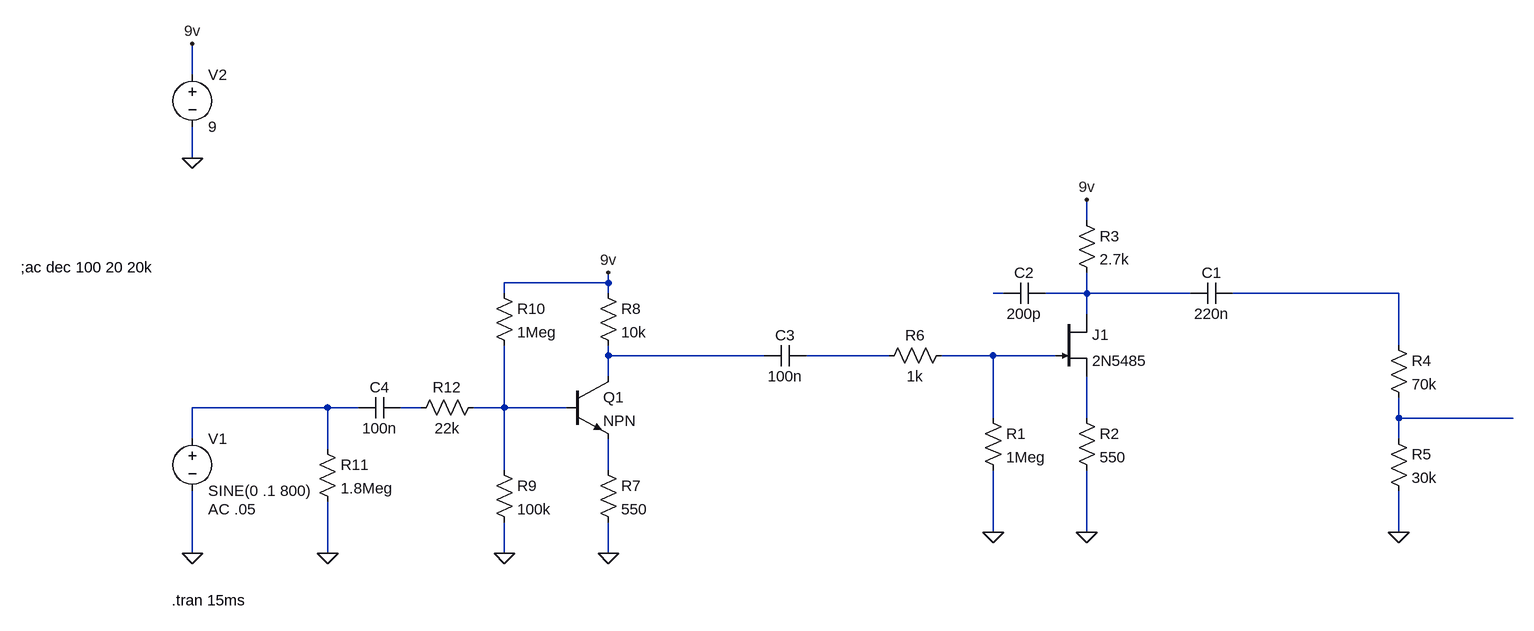
[diagram p0: schematic BJT_into_JFET.asc]
BJT_into_JFET.asc, the LTspice schematic file:
Version 4
SHEET 1 1188 680
WIRE -848 -192 -848 -240
WIRE -848 -64 -848 -112
WIRE 528 32 528 0
WIRE -208 128 -208 112
WIRE -208 128 -368 128
WIRE -368 144 -368 128
WIRE -208 144 -208 128
WIRE 400 144 384 144
WIRE 528 144 528 112
WIRE 528 144 464 144
WIRE 688 144 528 144
WIRE 1008 144 752 144
WIRE 528 176 528 144
WIRE 1008 224 1008 144
WIRE -208 240 -208 224
WIRE 32 240 -208 240
WIRE 224 240 96 240
WIRE 384 240 304 240
WIRE 480 240 384 240
WIRE -208 272 -208 240
WIRE -640 320 -848 320
WIRE -592 320 -640 320
WIRE -496 320 -528 320
WIRE -368 320 -368 224
WIRE -368 320 -416 320
WIRE -272 320 -368 320
WIRE 384 336 384 240
WIRE 528 336 528 272
WIRE 1008 336 1008 304
WIRE 1184 336 1008 336
WIRE -848 368 -848 320
WIRE 1008 368 1008 336
WIRE -640 384 -640 320
WIRE -368 416 -368 320
WIRE -208 416 -208 368
WIRE 384 512 384 416
WIRE 528 512 528 416
WIRE 1008 512 1008 448
WIRE -848 544 -848 448
WIRE -640 544 -640 464
WIRE -368 544 -368 496
WIRE -208 544 -208 496
FLAG 528 512 0
FLAG 384 512 0
FLAG 528 0 9v
FLAG 1008 512 0
FLAG -208 112 9v
FLAG -208 544 0
FLAG -368 544 0
FLAG -848 544 0
FLAG -640 544 0
FLAG -848 -64 0
FLAG -848 -240 9v
SYMBOL njf 480 176 R0
SYMATTR InstName J1
SYMATTR Value 2N5485
SYMBOL res 368 320 R0
SYMATTR InstName R1
SYMATTR Value 1Meg
SYMBOL res 512 320 R0
SYMATTR InstName R2
SYMATTR Value 550
SYMBOL res 512 16 R0
SYMATTR InstName R3
SYMATTR Value 2.7k
SYMBOL cap 752 128 R90
WINDOW 0 0 32 VBottom 2
WINDOW 3 32 32 VTop 2
SYMATTR InstName C1
SYMATTR Value 220n
SYMBOL res 992 208 R0
SYMATTR InstName R4
SYMATTR Value 70k
SYMBOL res 992 352 R0
SYMATTR InstName R5
SYMATTR Value 30k
SYMBOL cap 464 128 R90
WINDOW 0 0 32 VBottom 2
WINDOW 3 32 32 VTop 2
SYMATTR InstName C2
SYMATTR Value 200p
SYMBOL res 320 224 R90
WINDOW 0 0 56 VBottom 2
WINDOW 3 32 56 VTop 2
SYMATTR InstName R6
SYMATTR Value 1k
SYMBOL npn -272 272 R0
SYMATTR InstName Q1
SYMBOL cap 96 224 R90
WINDOW 0 0 32 VBottom 2
WINDOW 3 32 32 VTop 2
SYMATTR InstName C3
SYMATTR Value 100n
SYMBOL cap -528 304 R90
WINDOW 0 0 32 VBottom 2
WINDOW 3 32 32 VTop 2
SYMATTR InstName C4
SYMATTR Value 100n
SYMBOL res -224 400 R0
SYMATTR InstName R7
SYMATTR Value 550
SYMBOL res -224 128 R0
SYMATTR InstName R8
SYMATTR Value 10k
SYMBOL res -384 400 R0
SYMATTR InstName R9
SYMATTR Value 100k
SYMBOL res -384 128 R0
SYMATTR InstName R10
SYMATTR Value 1Meg
SYMBOL voltage -848 352 R0
WINDOW 123 24 124 Left 2
WINDOW 39 0 0 Left 2
SYMATTR Value2 AC .05
SYMATTR InstName V1
SYMATTR Value SINE(0 .1 800)
SYMBOL res -656 368 R0
SYMATTR InstName R11
SYMATTR Value 1.8Meg
SYMBOL voltage -848 -208 R0
WINDOW 123 0 0 Left 2
WINDOW 39 0 0 Left 2
SYMATTR InstName V2
SYMATTR Value 9
SYMBOL res -400 304 R90
WINDOW 0 0 56 VBottom 2
WINDOW 3 32 56 VTop 2
SYMATTR InstName R12
SYMATTR Value 22k
TEXT -880 616 Left 2 !.tran 15ms
TEXT -1112 104 Left 2 !;ac dec 100 20 20k

The netlist it stands for:
* BJT_into_JFET.asc
J1 N002 N006 N010 2N5485
R1 N006 0 1Meg
R2 N010 0 550
R3 9v N002 2.7k
C1 N003 N002 220n
R4 N003 N011 70k
R5 N011 0 30k
C2 N002 N001 200p
R6 N006 N005 1k
Q1 N004 N009 N012 0 NPN
C3 N005 N004 100n
C4 N008 N007 100n
R7 N012 0 550
R8 9v N004 10k
R9 N009 0 100k
R10 9v N009 1Meg
V1 N007 0 SINE(0 .1 800) AC .05
R11 N007 0 1.8Meg
V2 9v 0 9
R12 N009 N008 22k
.model NPN NPN
.model PNP PNP
.lib standard.bjt
.model NJF NJF
.model PJF PJF
.lib standard.jft
.tran 15ms
;ac dec 100 20 20k
.backanno
.end